# Altium project Buck_converter.PrjPcb
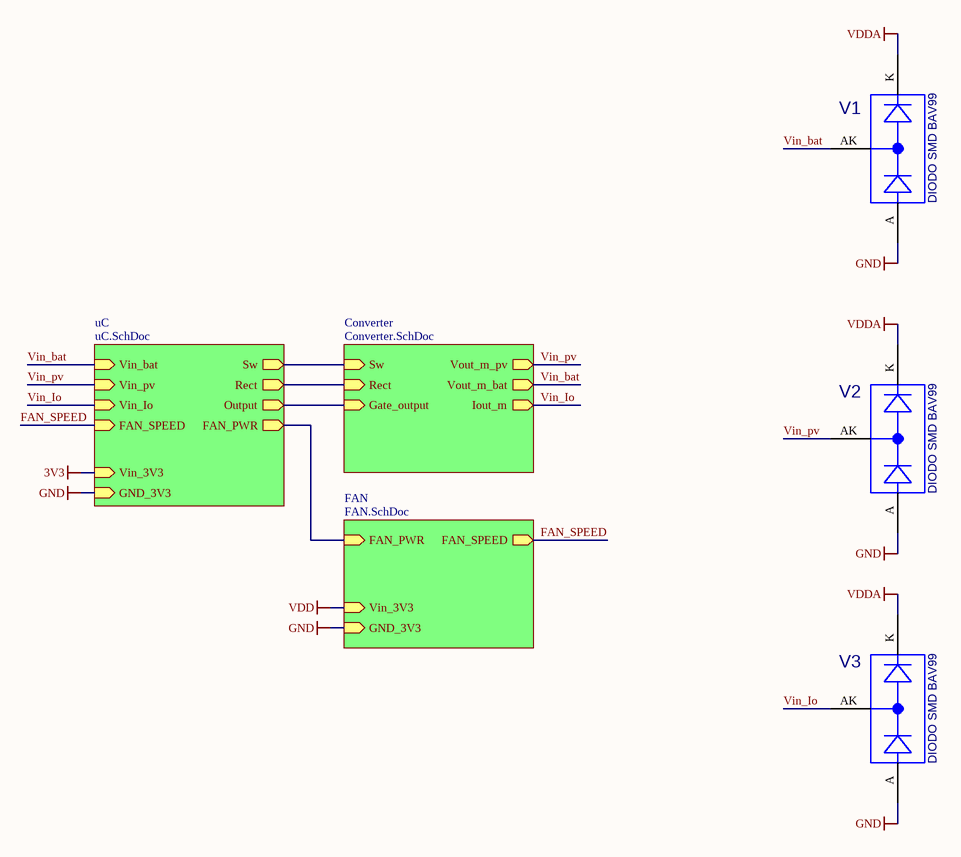
[diagram p0: Buck_converter.SchDoc]
Address1: Fábio Cadore Posser; Address2: Naelton Oliveira de Souza; organization: UDESC; SheetNumber: $SheetNumber; SheetTotal: $SheetTotal; Title: Buck Sinc Converter
10 sheets, 147 parts. Net scope: hierarchical (ports join the sheet entries above them; power ports are global).
Board file: Conv_buck_R1.PcbDoc
Sheets:
  Buck_converter.SchDoc
    uC = uC.SchDoc
    Converter = Converter.SchDoc
      Voltage_measure_pv = Voltage_measure.SchDoc
      Voltage_measure_bat = Voltage_measure.SchDoc
      Driver_rect = Driver_rect.SchDoc
      Current_measure_bat = Current_measure.SchDoc
      SMPS = SMPS.SchDoc
      Driver_SW = Driver_SW.SchDoc
      Output = Output.SchDoc
    FAN = FAN.SchDoc

## Sheet Buck_converter.SchDoc: Buck Sinc Converter
size A4; Organization: UDESC; Revision: R0; SheetNumber: 1; SheetTotal: 10

### Parts
V1  value DIODO SMD BAV99  [SOT23-BAV99A]  (hidden comment: 10574587)
V2  value DIODO SMD BAV99  [SOT23-BAV99A]  (hidden comment: 10574587)
V3  value DIODO SMD BAV99  [SOT23-BAV99A]  (hidden comment: 10574587)

### Sub-sheets
Converter = Converter.SchDoc: Sw (in), Rect (in), Vout_m_pv (out), Vout_m_bat (out), Iout_m (out), Gate_output (in)
FAN = FAN.SchDoc: FAN_PWR (in), GND_3V3 (in), FAN_SPEED (out), Vin_3V3 (in)
uC = uC.SchDoc: Vin_3V3 (in), GND_3V3 (in), Sw (out), Rect (out), Vin_bat (in), Vin_pv (in), Vin_Io (in), Output (out), FAN_SPEED (in), FAN_PWR (out)

### Nets
GND: V1.A V2.A V3.A ; sheet uC/GND_3V3, sheet FAN/GND_3V3
VDDA: V1.K V2.K V3.K
FAN_SPEED: sheet uC/FAN_SPEED, sheet FAN/FAN_SPEED
PWM1A: sheet uC/FAN_PWR, sheet FAN/FAN_PWR
PWM1B: sheet uC/Output, sheet Converter/Gate_output
PWM2B: sheet uC/Sw, sheet Converter/Sw
PWM3A: sheet uC/Rect, sheet Converter/Rect
Vin_bat: V1.AK ; sheet uC/Vin_bat, sheet Converter/Vout_m_bat  [project net Vbat]
Vin_Io: V3.AK ; sheet uC/Vin_Io, sheet Converter/Iout_m  [project net Io]
Vin_pv: V2.AK ; sheet uC/Vin_pv, sheet Converter/Vout_m_pv

### Notes on the sheet
- Title
- Size:
- Date:
- A4
- Number:
- Time:
- Revision:
- Sheet
- of
- File:

### Library data of the parts
V1-V3 = DIODO BAS40: DIODO SMD BAV99; HISitem: Criado em 06/04/15 (p/ Ricardo); PN: 10574587; PMT: SMD; ComponentLink1URL: http://www.onsemi.com/pub_link/Collateral/BAS40-04LT1-D.PDF

## Sheet uC.SchDoc: Buck Sinc Converter
size A4; Organization: UDESC; Revision: R0; SheetNumber: 8; SheetTotal: 10
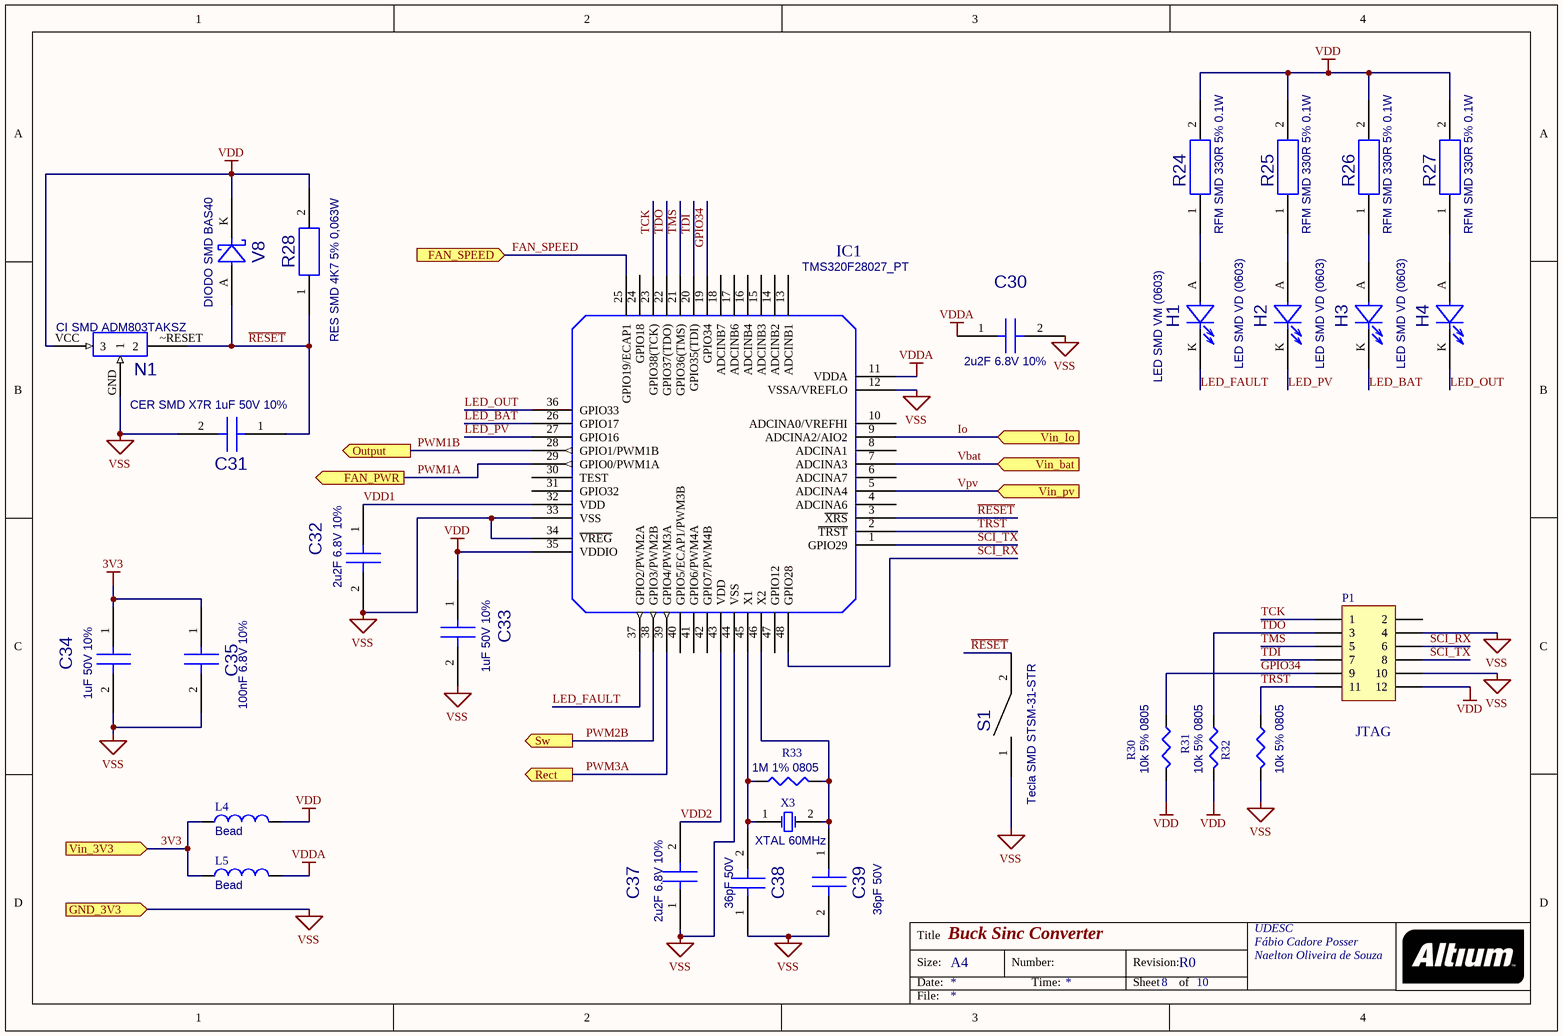
[diagram p1: uC.SchDoc]

### Parts
C30  2u2F 6.8V 10%  [C0805_R_V0]
C31  value CER SMD X7R 1uF 50V 10%  [C0805_R_V0]  (hidden comment: 11736520)
C32  2u2F 6.8V 10%  [C0805_R_V0]
C33  1uF 50V 10%  [C0805_R_V0]
C34  1uF 50V 10%  [C0805_R_V0]
C35  100nF 6.8V 10%  [C0805_R_V0]
C37  2u2F 6.8V 10%  [C0805_R_V0]
C38  36pF 50V  [C0805_R_V0]
C39  36pF 50V  [C0805_R_V0]
H1  value LED SMD VM (0603)  [LED 0603_12133537(Primary)]  (hidden comment: 12133537)
H2  value LED SMD VD (0603)  [LED 0603_12133535(Primary)]  (hidden comment: 12133535)
H3  value LED SMD VD (0603)  [LED 0603_12133535(Primary)]  (hidden comment: 12133535)
H4  value LED SMD VD (0603)  [LED 0603_12133535(Primary)]  (hidden comment: 12133535)
IC1  TMS320F28027_PT  [LQFP48]
L4  value Bead  [R0805_R_V0]  (hidden comment: Inductor)
L5  value Bead  [R0805_R_V0]  (hidden comment: Inductor)
N1  value CI SMD ADM803TAKSZ  [SC70A]  (hidden comment: 10050567)
P1  Header 6X2  [HDR2X6]  (value not drawn)
R24  value RFM SMD 330R 5% 0.1W  [R0805_R_V0]  (hidden comment: 10191962)
R25  value RFM SMD 330R 5% 0.1W  [R0805_R_V0]  (hidden comment: 10191962)
R26  value RFM SMD 330R 5% 0.1W  [R0805_R_V0]  (hidden comment: 10191962)
R27  value RFM SMD 330R 5% 0.1W  [R0805_R_V0]  (hidden comment: 10191962)
R28  value RES SMD 4K7 5% 0,063W  [R0805_R_V0]  (hidden comment: 11417855)
R30  value 10k 5% 0805  [R0805_R_V0]  (hidden comment: 1k 5% 0805)
R31  value 10k 5% 0805  [R0805_R_V0]  (hidden comment: 1k 5% 0805)
R32  value 10k 5% 0805  [R0805_R_V0]  (hidden comment: 1k 5% 0805)
R33  1M 1% 0805  [R0805_R_V0]
S1  value Tecla SMD STSM-31-STR  [TECLA STSM BOURNS]  (hidden comment: 10050610)
V8  value DIODO SMD BAS40  [SOT23A]  (hidden comment: 10192124)
X3  XTAL 60MHz  [XTAL  CSTCE_G_A]

### Ports
FAN_PWR (out), FAN_SPEED (in), GND_3V3 (in), Output (out), Rect (out), Sw (out), Vin_3V3 (in), Vin_bat (in), Vin_Io (in), Vin_pv (in)

### Nets
3V3: C34.1 C35.1 L4.1 L5.2 ; port Vin_3V3
VDD: C33.1 IC1.35(VDDIO) L4.2 N1.VCC(3) P1.12 R24.2 R25.2 R26.2 R27.2 R28.2 R30.2 R31.2 V8.K
VDDA: C30.1 IC1.11(VDDA) L5.1
VSS: C30.2 C31.2 C32.2 C33.2 C34.2 C35.2 C37.1 C38.1 C39.2 IC1.12(VSSA/VREFLO) IC1.33(VSS) IC1.34(~{VREG}) IC1.44(VSS) N1.GND(1) P1.4 P1.10 R32.2 S1.1 ; port GND_3V3  [project net GND]
~{RESET}: C31.1 IC1.3(~{XRS}) N1.~RESET(2) R28.1 S1.2 V8.A
FAN_SPEED: IC1.25(GPIO19/ECAP1) ; port FAN_SPEED
GPIO34: IC1.19(GPIO34) P1.9 R30.1
Io: IC1.9(ADCINA2/AIO2) ; port Vin_Io
LED_BAT: H3.K IC1.26(GPIO17)
LED_FAULT: H1.K IC1.37(GPIO2/PWM2A)
LED_OUT: H4.K IC1.36(GPIO33)
LED_PV: H2.K IC1.27(GPIO16)
PWM1A: IC1.29(GPIO0/PWM1A) ; port FAN_PWR
PWM1B: IC1.28(GPIO1/PWM1B) ; port Output
PWM2B: IC1.38(GPIO3/PWM2B) ; port Sw
PWM3A: IC1.39(GPIO4/PWM3A) ; port Rect
SCI_RX: IC1.48(GPIO28) P1.6
SCI_TX: IC1.1(GPIO29) P1.8
TCK: IC1.23(GPIO38(TCK)) P1.1
TDI: IC1.20(GPIO35(TDI)) P1.7
TDO: IC1.22(GPIO37(TDO)) P1.3 R31.1
TMS: IC1.21(GPIO36(TMS)) P1.5
TRST: IC1.2(~{TRST}) P1.11 R32.1
Vbat: IC1.7(ADCINA3) ; port Vin_bat
VDD1: C32.1 IC1.32(VDD)
VDD2: C37.2 IC1.43(VDD)
Vpv: IC1.5(ADCINA4) ; port Vin_pv  [project net Vin_pv]
NetC38_2: C38.2 IC1.45(X1) R33.1 X3.1(OSC1)
NetC39_1: C39.1 IC1.46(X2) R33.2 X3.2(OSC2)
NetH1_A: H1.A R24.1
NetH2_A: H2.A R25.1
NetH3_A: H3.A R26.1
NetH4_A: H4.A R27.1

Not connected (* = marked no-connect by the designer): IC1 4(ADCINA6) 6(ADCINA7) 8(ADCINA1) 10(ADCINA0/VREFHI) 13(ADCINB1) 14(ADCINB2) 15(ADCINB3) 16(ADCINB4) 17(ADCINB6) 18(ADCINB7) 24(GPIO18) 30(TEST) 31(GPIO32) 40(GPIO5/ECAP1/PWM3B) 41(GPIO6/PWM4A) 42(GPIO7/PWM4B) 47(GPIO12); P1 2; V8 NC

### Notes on the sheet
- (near P1) JTAG
- Title
- Size:
- Date:
- A4
- Number:
- Time:
- Revision:
- Sheet
- of
- File:

### Library data of the parts
C30 C32 C37 = 11736520: CER SMD X7R 1uF 50V 10%; HISsym: Atualizado em 12/07/05; PN: 10192095; HISitem: Criado em 15/04/11 (p/ Sandro W.); PMT: SMD; Value: 2u2F 6.8V 10%
C31 C33 C34 = 11736520: CER SMD X7R 1uF 50V 10%; HISsym: Atualizado em 12/07/05; HISitem: Criado em 15/04/11 (p/ Sandro W.); PN: 11736520; PMT: SMD
  C33 C34: Value: 1uF 50V 10%
C35 = 11736520: CER SMD X7R 1uF 50V 10%; HISsym: Atualizado em 12/07/05; PN: 10192075; HISitem: Criado em 15/04/11 (p/ Sandro W.); PMT: SMD; Value: 100nF 6.8V 10%
C38 C39 = 11736520: CER SMD C0G 36pF 50V; HISsym: Atualizado em 12/07/05; HISitem: Criado em 15/04/11 (p/ Sandro W.); PN: 11736520; PMT: SMD; Value: 36pF 50V
H1 = 12133537: LED SMD VM (0603); HISitem: Criado em 31/08/11 (p/ Ricardo); PN: 12133537; PMT: SMD
H2-H4 = 12133535: LED SMD VD (0603); HISitem: Criado em 31/08/11 (p/ Ricardo); PN: 12133535; PMT: SMD
IC1 = TMS320F28027_PT: LQFP48; EECON Code: XXX; Text Field 1: TEXAS; Componente: DSX LQFP48; Text Field: TMS320F28027_PT; DES: XXX; Value: TMS320F28027_PT
L4 L5 = Inductor: Code_IEC: 1005; PN: 12436892; Published: 8-Jun-2000; LatestRevisionDate: 29-May-2009; LatestRevisionNote: IPC-7351 Footprint Added.; PackageReference: 0402-A; Publisher: Altium Limited; PackageDescription: Chip Inductor; Code_JEITA: 0402
N1 = 10050567: CI SMD ADM803TAKSZ; HISsym: Atualizado em 16/08/05; HISitem: Alterado encaps. para SC70 em 16/08/05; PN: 10050567; PMT: SMD
P1 = Header 6X2: Header, 6-Pin, Dual row; LatestRevisionDate: 17-Jul-2002; LatestRevisionNote: Re-released for DXP Platform.; Publisher: Altium Limited
R24-R27 = 10191962: RFM SMD 330R 5% 0.1W; HISsym: Atualizado em 20/07/05; PN: 10191962; PMT: SMD
R28 = 11417855: RES SMD 4K7 5% 0,063W; HISsym: Atualizado em 20/07/05; HISitem: Criado em 23/04/10 (p/ Ricardo); PN: 11417855; PMT: SMD
R30-R32 = Res3_2: Resistor; PN: 10192008; PMT: SMD; Published: 8-Jun-2000; LatestRevisionDate: 29-May-2009; LatestRevisionNote: IPC-7351 Footprint Added.; PackageReference: J1-0603; Publisher: Altium Limited; PackageDescription: Chip Resistor
R33 = Res3_2: Resistor; PN: 10118079; PMT: SMD; Published: 8-Jun-2000; LatestRevisionDate: 29-May-2009; LatestRevisionNote: IPC-7351 Footprint Added.; PackageReference: J1-0603; Publisher: Altium Limited; PackageDescription: Chip Resistor; Value: 1M 1% 0805
S1 = 10050610: Tecla SMD STSM-31-STR; NUMBER PIN: 02; PN: 10050610; PMT: SMD
V8 = 10192124: DIODO SMD BAS40; HISsym: Atualizado em 10/07/06; NUMBER PIN: 02; PN: 10192124; PMT: SMD
X3 = XTAL: Crystal Oscillator; PMT: SMD; Published: 8-Jun-2000; LatestRevisionDate: 17-Jul-2002; LatestRevisionNote: Re-released for DXP Platform.; PackageReference: R38; Publisher: Altium Limited; Value: XTAL 60MHz

## Sheet Converter.SchDoc: Buck Sinc Converter
size A4; Organization: UDESC; Revision: R0; SheetNumber: 2; SheetTotal: 10
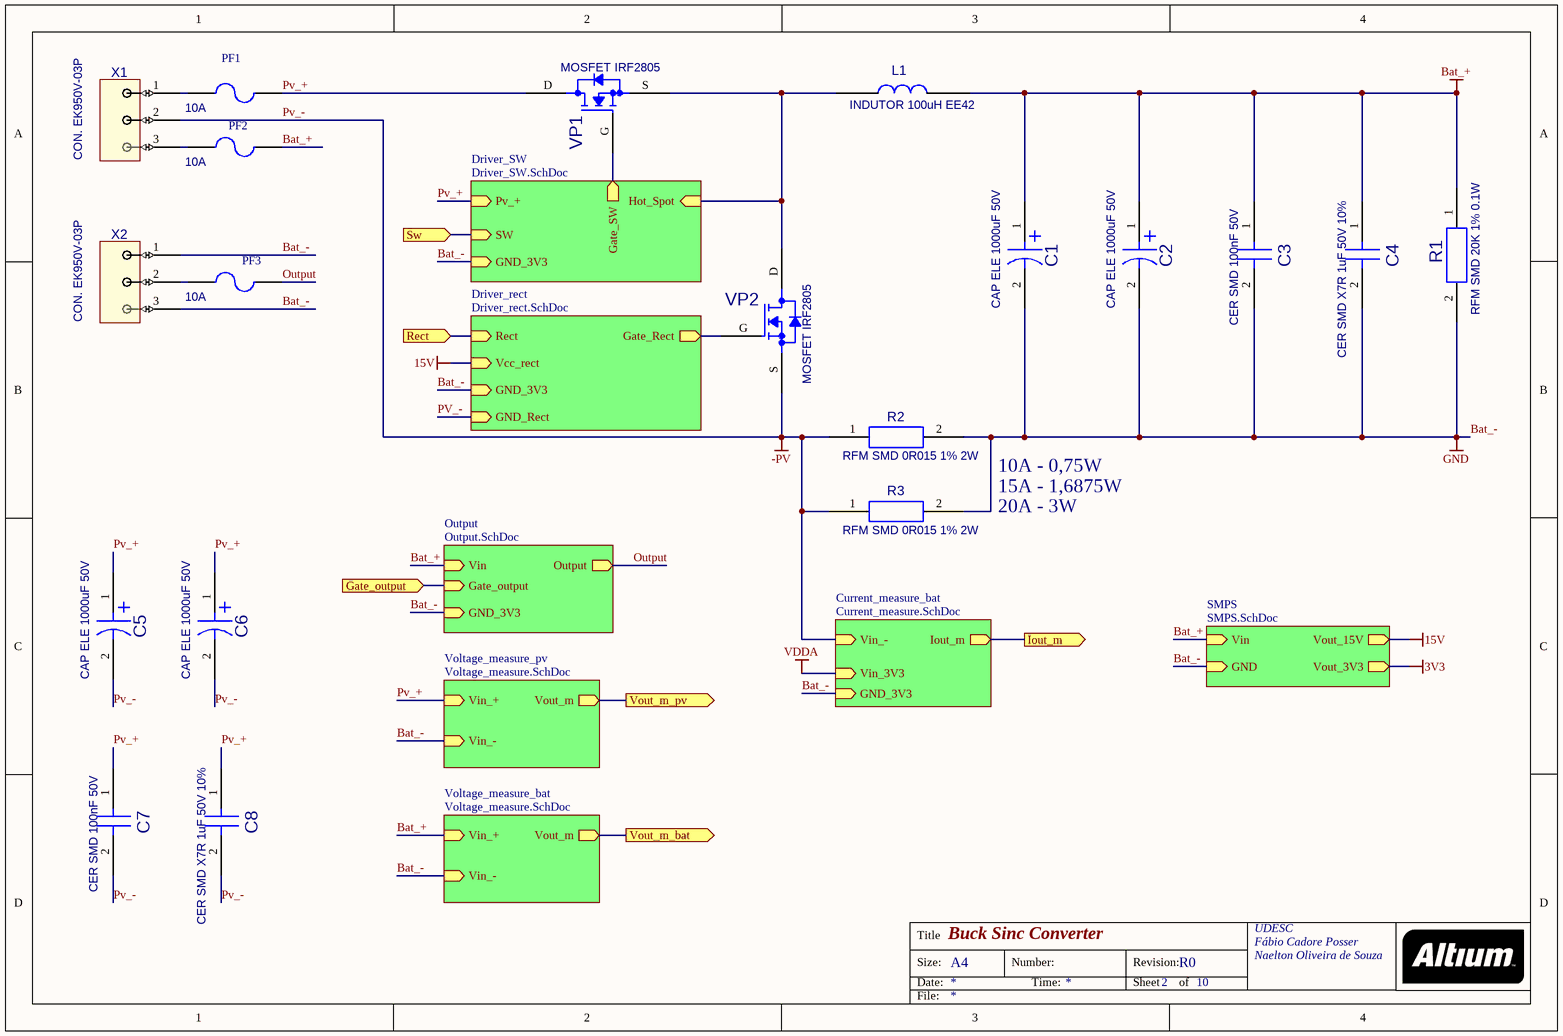
[diagram p2: Converter.SchDoc]

### Parts
C1  value CAP ELE 1000uF 50V  [CR 1.1 7.62 16.5]  (hidden comment: 10190340)
C2  value CAP ELE 1000uF 50V  [CR 1.1 7.62 16.5]  (hidden comment: 10190340)
C3  value CER SMD 100nF 50V  [C0805_R_V0]  (hidden comment: 10192075)
C4  value CER SMD X7R 1uF 50V 10%  [C0805_R_V0]  (hidden comment: 11736520)
C5  value CAP ELE 1000uF 50V  [CR 1.1 7.62 16.5]  (hidden comment: 10190340)
C6  value CAP ELE 1000uF 50V  [CR 1.1 7.62 16.5]  (hidden comment: 10190340)
C7  value CER SMD 100nF 50V  [C0805_R_V0]  (hidden comment: 10192075)
C8  value CER SMD X7R 1uF 50V 10%  [C0805_R_V0]  (hidden comment: 11736520)
L1  INDUTOR 100uH EE42  [INDUTOR EE42_V1]
PF1  10A  [Fuse_holder]
PF2  10A  [Fuse_holder]
PF3  10A  [Fuse_holder]
R1  value RFM SMD 20K 1% 0.1W  [R0805A]  (hidden comment: 10191996)
R2  value RFM SMD 0R015 1% 2W  [WSL2816A]  (hidden comment: 11372881)
R3  value RFM SMD 0R015 1% 2W  [WSL2816A]  (hidden comment: 11372881)
VP1  value MOSFET IRF2805  [TO-220AB_V1]  (hidden comment: 10190449)
VP2  value MOSFET IRF2805  [TO-220AB_V1]  (hidden comment: 10190449)
X1  value CON. EK950V-03P  [662-A-111/03-SM]  (hidden comment: 10233722)
X2  value CON. EK950V-03P  [662-A-111/03-SM]  (hidden comment: 10233722)

### Sub-sheets
Current_measure_bat = Current_measure.SchDoc: Vin_- (in), Iout_m (out), Vin_3V3 (in), GND_3V3 (in)
Driver_rect = Driver_rect.SchDoc: Rect (in), Gate_Rect (out), GND_3V3 (in), Vcc_rect (in), GND_Rect (in)
Driver_SW = Driver_SW.SchDoc: Pv_+ (in), Gate_SW (out), GND_3V3 (in), SW (in), Hot_Spot (in)
Output = Output.SchDoc: Gate_output (in), GND_3V3 (in), Output (out), Vin (in)
SMPS = SMPS.SchDoc: Vin (in), GND (in), Vout_3V3 (out), Vout_15V (out)
Voltage_measure_bat = Voltage_measure.SchDoc: Vin_+ (in), Vin_- (in), Vout_m (out)
Voltage_measure_pv = Voltage_measure.SchDoc: Vin_+ (in), Vin_- (in), Vout_m (out)

### Ports
Gate_output (in), Iout_m (out), Rect (in), Sw (in), Vout_m_bat (out), Vout_m_pv (out)

### Nets
15V: sheet Driver_rect/Vcc_rect, sheet SMPS/Vout_15V
-PV: C5.2 C6.2 C7.2 C8.2 R2.1 R3.1 VP2.S X1.2 ; sheet Driver_rect/GND_Rect, sheet Current_measure_bat/Vin_-  [also labelled Pv_-]
Bat_+: C1.1 C2.1 C3.1 C4.1 L1.2 PF2.2 R1.1 ; sheet Voltage_measure_bat/Vin_+, sheet SMPS/Vin, sheet Output/Vin
GND: C1.2 C2.2 C3.2 C4.2 R1.2 R2.2 R3.2 X2.1 X2.3 ; sheet Voltage_measure_pv/Vin_-, sheet Voltage_measure_bat/Vin_-, sheet Driver_rect/GND_3V3, sheet Current_measure_bat/GND_3V3, sheet SMPS/GND, sheet Driver_SW/GND_3V3, sheet Output/GND_3V3  [also labelled Bat_-]
Gate_Rect: VP2.G ; sheet Driver_rect/Gate_Rect
Gate_SW: VP1.G ; sheet Driver_SW/Gate_SW
Hot_Spot: L1.1 VP1.S VP2.D ; sheet Driver_SW/Hot_Spot
Io: port Iout_m, sheet Current_measure_bat/Iout_m
Output: PF3.2 ; sheet Output/Output
Pv_+: C5.1 C6.1 C7.1 C8.1 PF1.2 VP1.D ; sheet Voltage_measure_pv/Vin_+, sheet Driver_SW/Pv_+
PWM1B: port Gate_output, sheet Output/Gate_output
PWM2B: port Sw, sheet Driver_SW/SW
PWM3A: port Rect, sheet Driver_rect/Rect
Vbat: port Vout_m_bat, sheet Voltage_measure_bat/Vout_m
Vin_pv: port Vout_m_pv, sheet Voltage_measure_pv/Vout_m
NetPF1_1: PF1.1 X1.1
NetPF2_1: PF2.1 X1.3
NetPF3_1: PF3.1 X2.2

### Notes on the sheet
- 10A - 0,75W
- 15A - 1,6875W
- 20A - 3W
- Title
- Size:
- Date:
- A4
- Number:
- Time:
- Revision:
- Sheet
- of
- File:

### Library data of the parts
C1 C2 C5 C6 = 10190340: CAP ELE 1000uF 50V; HISsym: Atualizado em 19/10/05; TOL: 20%; PMT: THT; PN: 10190340
C3 C7 = 10192075: CER SMD 100nF 50V; HISsym: Atualizado em 12/07/05; TOL: 10%; ITEM BAAN: 0333.0044; PN: 10192075; PMT: SMD
C4 C8 = 11736520: as C31 on sheet uC; PN: 11736520; PMT: SMD
L1 = 12578205: INDUTOR 560uH 4A PCV-2; HISitem: Criado em 18/04/13 (p/ Adriano); Altura: 28mm; PMT: THT; PN: 12578205; ComponenteLink1URL: http://www.coilcraft.com/pdfs/pcv.pdf; Value: INDUTOR 100uH EE42
PF1 = Fuse 2: PN: FUSE; PMT: THT; Published: 8-Jun-2000; LatestRevisionDate: 17-Jul-2002; LatestRevisionNote: Re-released for DXP Platform.; PackageReference: PIN-W2/E2.8; Publisher: Altium Limited; Value: 10A
PF2 PF3 = Fuse 2: Fuse; PMT: THT; Published: 8-Jun-2000; LatestRevisionDate: 17-Jul-2002; LatestRevisionNote: Re-released for DXP Platform.; PackageReference: PIN-W2/E2.8; Publisher: Altium Limited; PN: 10A; Value: 10A
R1 = 10191996: RFM SMD 20K 1% 0.1W; HISsym: Atualizado em 20/07/05; PN: 10191996; PMT: SMD
R2 R3 = 11372881: RFM SMD 0R015 1% 2W; HISsym: Atualizado em 20/07/05; HISitem: Criado em 19/01/10 (p/ Emilio); PN: 11372881; PMT: SMD; ComponentLink1URL: *
VP1 VP2 = 10190449: MOSFET IRFB31N20D; HISsym: Atualizado em 20/04/06; HISitem: Criado em 20/04/06; PMT: THT; PN: 10190449
X1 X2 = 10233722: CON. EK950V-03P; HISitem: Atualizado Pattern em 01/09/06; Altura: 21,6mm; PMT: THT; PN: 10233722; ComponentLink1URL: *

## Sheet Voltage_measure.SchDoc: Buck Sinc Converter
size A4; Organization: UDESC; Revision: R0; SheetNumber: 6; SheetTotal: 10
Used 2 times, as channels Converter/Voltage_measure_pv, Converter/Voltage_measure_bat. Parts and nets are listed once, with the designators drawn on the sheet.
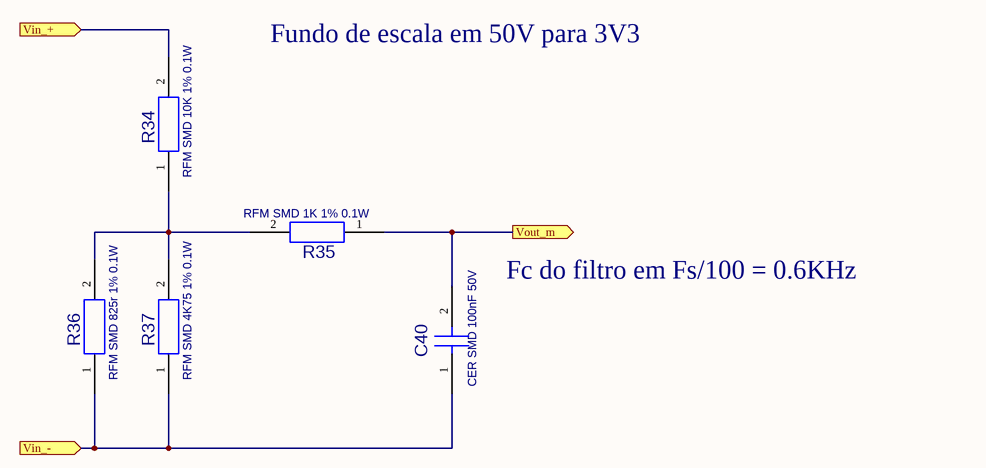
[diagram p3: Voltage_measure.SchDoc]

### Parts
C40  value CER SMD 100nF 50V  [C0805_R_V0]  (hidden comment: 10192075)
R34  value RFM SMD 10K 1% 0.1W  [R0805_R_V0]  (hidden comment: 10118076)
R35  value RFM SMD 1K 1% 0.1W  [R0805_R_V0]  (hidden comment: 10118077)
R36  value RFM SMD 825r 1% 0.1W  [R0805_R_V0]  (hidden comment: 10191983)
R37  value RFM SMD 4K75 1% 0.1W  [R0805_R_V0]  (hidden comment: 10191972)

### Ports
Vin_+ (in), Vin_- (in), Vout_m (out)

### Nets
Vin_+: R34.2 ; port Vin_+
Vin_-: C40.1 R36.1 R37.1 ; port Vin_-
Vout_m: C40.2 R35.1 ; port Vout_m
NetR34_1: R34.1 R35.2 R36.2 R37.2

### Channels
Converter/Voltage_measure_pv: designators C40=C47 R34=R54 R35=R55 R36=R56 R37=R57; ports Vin_+=Pv_+ Vin_-=GND Vout_m=Vin_pv
Converter/Voltage_measure_bat: designators C40=C46#1 R34=R50#1 R35=R51#1 R36=R52#1 R37=R53#1; ports Vin_+=Bat_+ Vin_-=GND Vout_m=Vbat

### Notes on the sheet
- Fundo de escala em 50V para 3V3
- Fc do filtro em Fs/100 = 0.6KHz
- Title
- Size:
- Date:
- A4
- Number:
- Time:
- Revision:
- Sheet
- of
- File:

### Library data of the parts
C40 = 10192075: as C3 on sheet Converter; PN: 10192075; PMT: SMD
R34 = 10118077: RFM SMD 10K 1% 0.1W; HISsym: Atualizado em 20/07/05; PN: 10118076; PMT: SMD
R35 = 10118077: RFM SMD 1K 1% 0.1W; HISsym: Atualizado em 20/07/05; PN: 10118077; PMT: SMD
R36 = 10118077: RFM SMD 825r 1% 0.1W; HISsym: Atualizado em 20/07/05; PN: 10191983; PMT: SMD
R37 = 10118077: RFM SMD 4K75 1% 0.1W; HISsym: Atualizado em 20/07/05; PN: 10191972; PMT: SMD

## Sheet Driver_rect.SchDoc: Buck Sinc Converter
size A4; Organization: UDESC; Revision: R0; SheetNumber: 4; SheetTotal: 10; DocumentFullPathAndName: PROJETO PSE
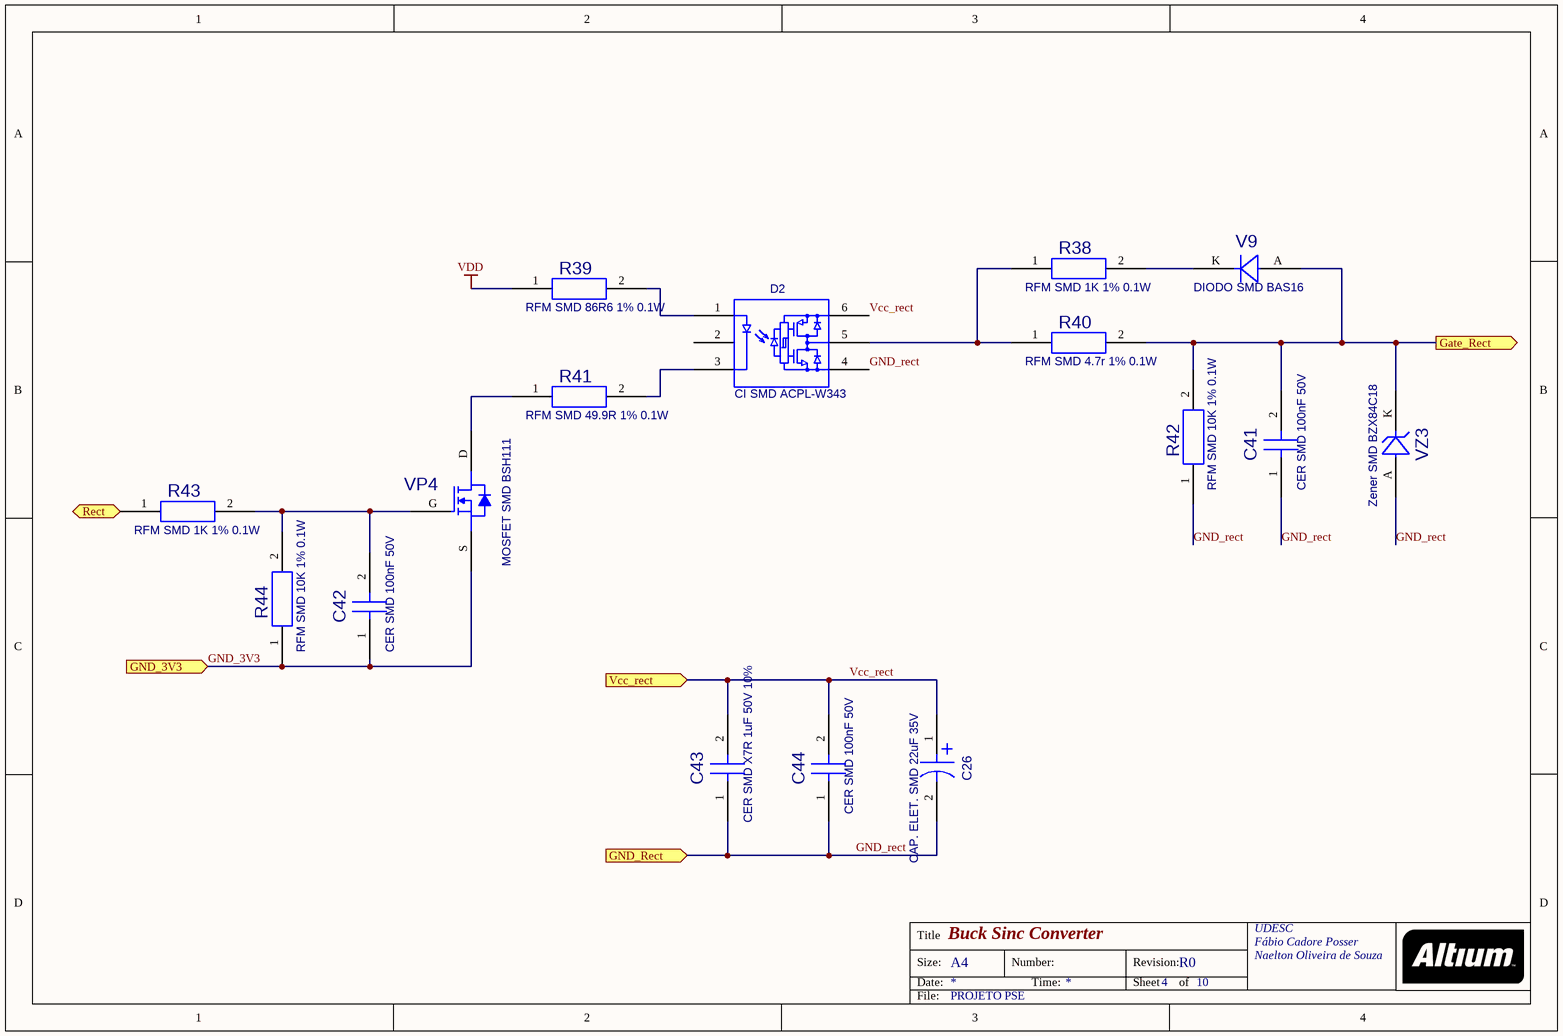
[diagram p4: Driver_rect.SchDoc]

### Parts
C26  value CAP. ELET. SMD 22uF 35V  [CAP UUD CR 5X5.8]  (hidden comment: 11690909)
C41  value CER SMD 100nF 50V  [C0805_R_V0]  (hidden comment: 10192075)
C42  value CER SMD 100nF 50V  [C0805_R_V0]  (hidden comment: 10192075)
C43  value CER SMD X7R 1uF 50V 10%  [C0805_R_V0]  (hidden comment: 11736520)
C44  value CER SMD 100nF 50V  [C0805_R_V0]  (hidden comment: 10192075)
D2  value CI SMD ACPL-W343  [SO-6 (11.5 MM)]  (hidden comment: 12544475)
R38  value RFM SMD 1K 1% 0.1W  [R0805_R_V0]  (hidden comment: 10118077)
R39  value RFM SMD 86R6 1% 0.1W  [R0805_R_V0]  (hidden comment: 10192050)
R40  value RFM SMD 4.7r 1% 0.1W  [R0805_R_V0]  (hidden comment: 10192015)
R41  value RFM SMD 49.9R 1% 0.1W  [R0805_R_V0]  (hidden comment: 10192035)
R42  value RFM SMD 10K 1% 0.1W  [R0805_R_V0]  (hidden comment: 10118076)
R43  value RFM SMD 1K 1% 0.1W  [R0805_R_V0]  (hidden comment: 10118077)
R44  value RFM SMD 10K 1% 0.1W  [R0805_R_V0]  (hidden comment: 10118076)
V9  value DIODO SMD BAS16  [SOT23A]  (hidden comment: 10261302)
VP4  value MOSFET SMD BSH111  [MOS_SOT23A]  (hidden comment: 11110327)
VZ3  value Zener SMD BZX84C18  [ZEN_SOT23A]  (hidden comment: 10050447)

### Ports
Gate_Rect (out), GND_3V3 (in), GND_Rect (in), Rect (in), Vcc_rect (in)

### Nets
GND_3V3: C42.1 R44.1 VP4.S ; port GND_3V3  [project net GND]
GND_rect: C26.2 C41.1 C43.1 C44.1 D2.4(VEE) R42.1 VZ3.A ; port GND_Rect  [project net -PV]
Vcc_rect: C26.1 C43.2 C44.2 D2.6(VCC) ; port Vcc_rect  [project net 15V]
VDD: R39.1
Gate_Rect: C41.2 R40.2 R42.2 V9.A VZ3.K ; port Gate_Rect
PWM3A: R43.1 ; port Rect
NetC42_2: C42.2 R43.2 R44.2 VP4.G
NetD2_1: D2.1(A) R39.2
NetD2_3: D2.3(K) R41.2
NetD2_5: D2.5(VOUT) R38.1 R40.1
NetR38_2: R38.2 V9.K
NetR41_1: R41.1 VP4.D

Not connected (* = marked no-connect by the designer): D2 2; V9 NC; VZ3 NC

### Notes on the sheet
- Title
- Size:
- Date:
- A4
- Number:
- Time:
- Revision:
- Sheet
- of
- File:

### Library data of the parts
C26 = 11690909: CAP. ELET. SMD 22uF 35V; HISsym: Atualizado em 20/12/05; TOL: 20%; HISitem: Criado em 02/03/11 (p/ Osnir); Altura: 5,8mm; PN: 11690909; PMT: SMD; ComponenteLink1URL: *
C41 C42 C44 = 10192075: as C3 on sheet Converter; PN: 10192075; PMT: SMD
C43 = 11736520: as C31 on sheet uC; PN: 11736520; PMT: SMD
D2 = 12544475: CI SMD ACPL-W343; HISitem: Criado em 04/04/13 (p/ Geovani); PN: 12544475; PMT: SMD; ComponentLink1URL: http://www.avagotech.com/docs/AV02-2928EN
R38 R43 = 10118077: as R35 on sheet Voltage_measure; PN: 10118077; PMT: SMD
R39 = 10118077: RFM SMD 86R6 1% 0.1W; HISsym: Atualizado em 20/07/05; PN: 10192050; PMT: SMD
R40 = 10118077: RFM SMD 4.7r 1% 0.1W; HISsym: Atualizado em 20/07/05; PN: 10192015; PMT: SMD
R41 = 10118077: RFM SMD 49.9R 1% 0.1W; HISsym: Atualizado em 20/07/05; PN: 10192035; PMT: SMD
R42 R44 = 10118077: as R34 on sheet Voltage_measure; PN: 10118076; PMT: SMD
V9 = 10261302: DIODO SMD BAS16; HISsym: Atualizado em 17/04/06; VAL: 200mA; PN: 10261302; PMT: SMD
VP4 = 11110327: MOSFET SMD BSH111; HISsym: Atualizado em 12/09/05; HISitem: Criado em 20/12/07 (p/ Ricardo); PN: 11110327; PMT: SMD
VZ3 = 10050447: Zener  SMD BZX84C18; HISsym: Atualizado em 11/07/06; NUMBER PIN: 03; PN: 10050447; PMT: SMD

## Sheet Current_measure.SchDoc: Buck Sinc Converter
size A4; Organization: UDESC; Revision: R0; SheetNumber: 5; SheetTotal: 10
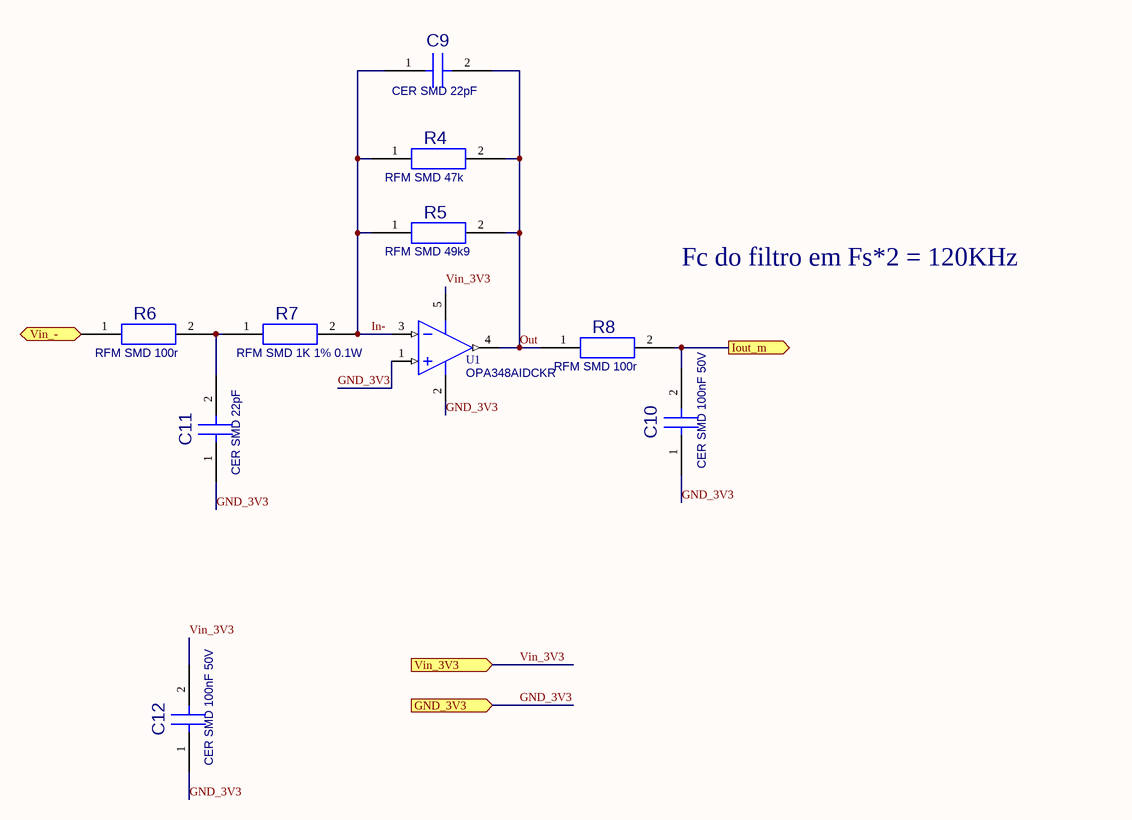
[diagram p5: Current_measure.SchDoc]

### Parts
C9  value CER SMD 22pF  [C0805_R_V0]  (hidden comment: 10192073)
C10  value CER SMD 100nF 50V  [C0805_R_V0]  (hidden comment: 10192075)
C11  value CER SMD 22pF  [C0805_R_V0]  (hidden comment: 10192073)
C12  value CER SMD 100nF 50V  [C0805_R_V0]  (hidden comment: 10192075)
R4  value RFM SMD 47k  [R0805_R_V0]  (hidden comment: 12314309)
R5  value RFM SMD 49k9  [R0805_R_V0]  (hidden comment: 10192018)
R6  value RFM SMD 100r  [R0805_R_V0]  (hidden comment: 10118083)
R7  value RFM SMD 1K 1% 0.1W  [R0805_R_V0]  (hidden comment: 10118077)
R8  value RFM SMD 100r  [R0805_R_V0]  (hidden comment: 10118083)
U1  OPA348AIDCKR  [DCK R-PDSO-G5]

### Ports
GND_3V3 (in), Iout_m (out), Vin_3V3 (in), Vin_- (in)

### Nets
-PV: R6.1 ; port Vin_-
GND_3V3: C10.1 C11.1 C12.1 U1.1(IN+) U1.2(V-) ; port GND_3V3  [project net GND]
Vin_3V3: C12.2 U1.5(V+) ; port Vin_3V3  [project net VDDA]
In-: C9.1 R4.1 R5.1 R7.2 U1.3(IN-)
Io: C10.2 R8.2 ; port Iout_m
Out: C9.2 R4.2 R5.2 R8.1 U1.4(OUT)
NetC11_2: C11.2 R6.2 R7.1

### Notes on the sheet
- Fc do filtro em Fs*2 = 120KHz
- Title
- Size:
- Date:
- A4
- Number:
- Time:
- Revision:
- Sheet
- of
- File:

### Library data of the parts
C9 C11 = 10192075: CER SMD 22pF; HISsym: Atualizado em 12/07/05; TOL: 10%; ITEM BAAN: 0333.0044; PN: 10192073; PMT: SMD
C10 C12 = 10192075: as C3 on sheet Converter; PN: 10192075; PMT: SMD
R4 = 10118077: RFM SMD 47k; HISsym: Atualizado em 20/07/05; PN: 12314309; PMT: SMD
R5 = 10118077: RFM SMD 49k9; HISsym: Atualizado em 20/07/05; PN: 10192018; PMT: SMD
R6 R8 = 10118077: RFM SMD 100r; HISsym: Atualizado em 20/07/05; PN: 10118083; PMT: SMD
R7 = 10118077: as R35 on sheet Voltage_measure; PN: 10118077; PMT: SMD
U1 = OPA348AIDCKR: 1 MHz, 45 uA, RRIO, Single Operational Amplifier, 2.1 to 5.5 V, -40 to 125 degC, 5-pin SOT23 (DCK5), Green (RoHS & no Sb/Br); Manufacturer: Texas Instruments; CMRR(Min)(dB): 70; GBW(Typ)(MHz): 1; IIB(Max)(pA): 10; Iq per channel(Max)(mA): 0.065; Offset Drift(Typ)(uV/C): 4; Packing: LARGE T&R; Rating: Catalog; Slew Rate(Typ)(V/us): 0.5; Sub Family: Low Input Bias Current Amp (<=10pA), Low Power Amp (<=500uA), Low Supply Voltage Amplifier (<=2.7V), Precision Amplifier; Total Supply Voltage(Max)(+5V is 5, +/-5V is 10): 5.5; Total Supply Voltage(Min)(+5V is 5, +/-5V is 10): 2.1; Vio (25C)(Max)(mV): 5; PN: 11354940; PMT: SMD; DatasheetVersion: SBOS213G; PackageVersion: 4093553-3/G, 01/2007; PackageReference: DCK5; PackageDescription: 5-Pin Plastic Small Outline, Body 2 x 1.25 mm, Pitch 0.65 mm; Supplier 1: Digi-Key; Supplier Part Number 1: 296-27989-2-ND; Supplier 2: Digi-Key; Supplier Part Number 2: 296-27989-1-ND; Supplier 3: Digi-Key; Supplier Part Number 3: 296-27989-6-ND; Supplier 4: Newark; Supplier Part Number 4: 86W6065; Supplier 5: Newark; Supplier Part Number 5: 75C4889; Supplier 6: Mouser; Supplier Part Number 6: 595-OPA348AIDCKR; Eco-Plan: Green (RoHS & no Sb/Br); Number of Channels: 1; Mounting Technology: Surface Mount; Code_JEDEC: MO-203; ComponentLink1Description: Manufacturer URL; ComponentLink1URL: http://www.ti.com/; ComponentLink2Description: Datasheet; ComponentLink2URL: http://www.ti.com/lit/ds/symlink/opa348.pdf; ComponentLink3Description: Package Specification; ComponentLink3URL: http://www.ti.com/litv/pdf/mpds025f; Value: OPA348AIDCKR

## Sheet SMPS.SchDoc: Buck Sinc Converter
size A4; Organization: UDESC; Revision: R0; SheetNumber: 7; SheetTotal: 10
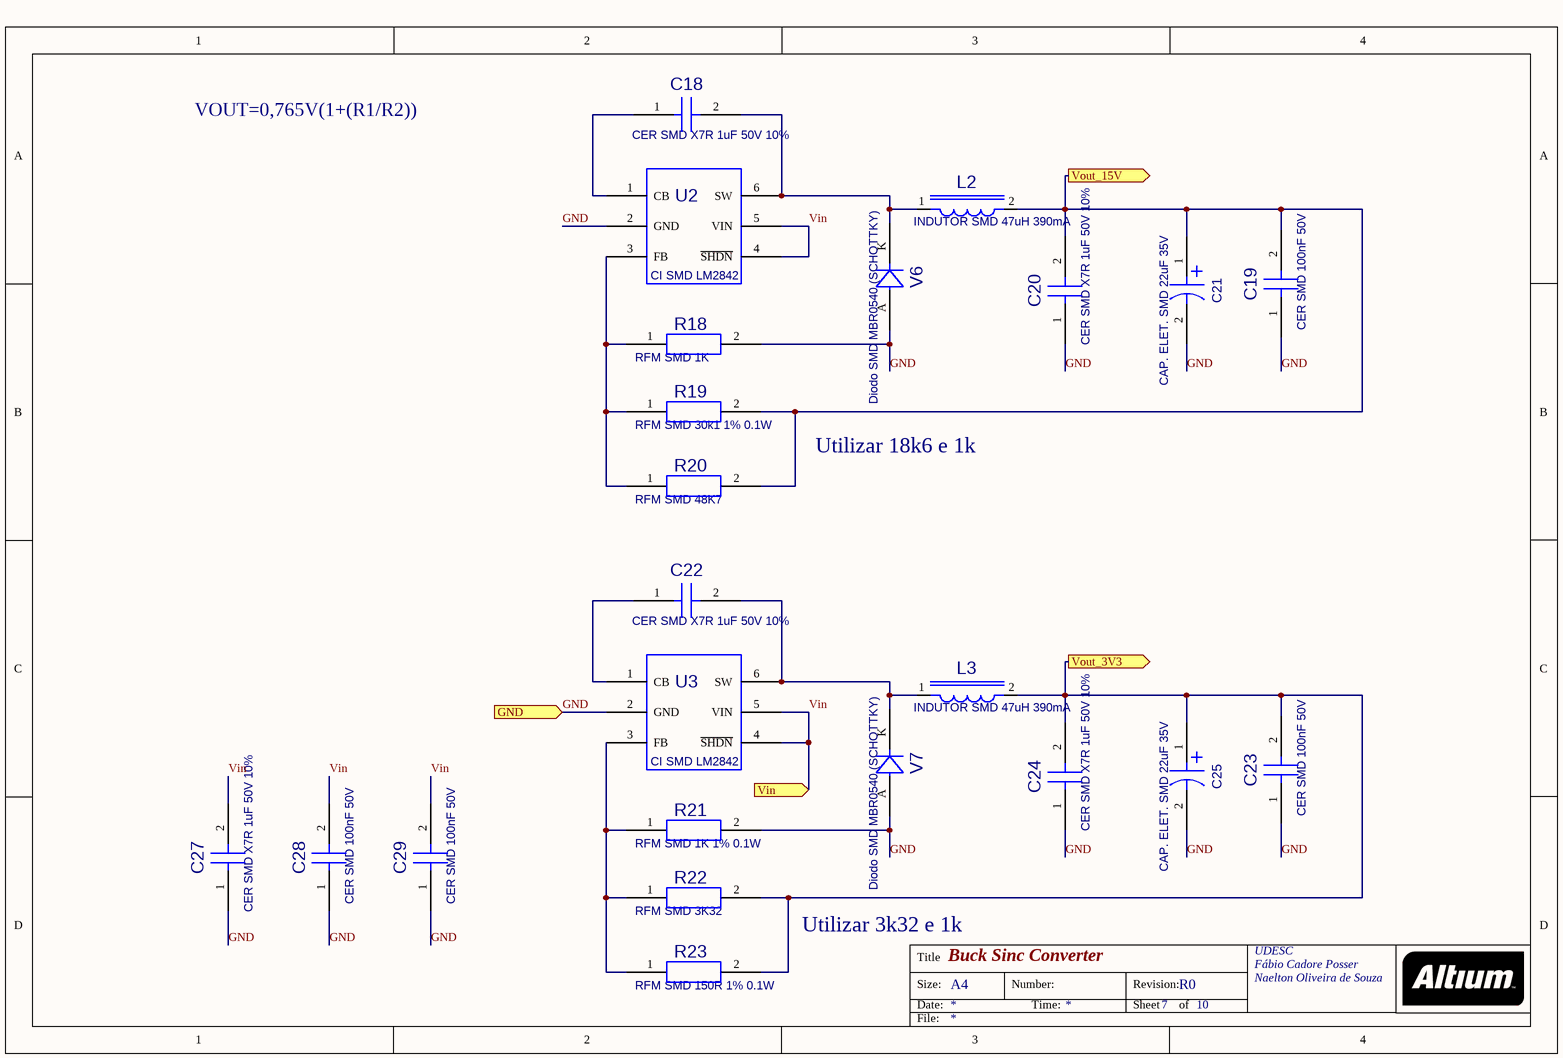
[diagram p6: SMPS.SchDoc]

### Parts
C18  value CER SMD X7R 1uF 50V 10%  [C0805_R_V0]  (hidden comment: 11736520)
C19  value CER SMD 100nF 50V  [C0805_R_V0]  (hidden comment: 10192075)
C20  value CER SMD X7R 1uF 50V 10%  [C0805_R_V0]  (hidden comment: 11736520)
C21  value CAP. ELET. SMD 22uF 35V  [CAP UUD CR 5X5.8]  (hidden comment: 11690909)
C22  value CER SMD X7R 1uF 50V 10%  [C0805_R_V0]  (hidden comment: 11736520)
C23  value CER SMD 100nF 50V  [C0805_R_V0]  (hidden comment: 10192075)
C24  value CER SMD X7R 1uF 50V 10%  [C0805_R_V0]  (hidden comment: 11736520)
C25  value CAP. ELET. SMD 22uF 35V  [CAP UUD CR 5X5.8]  (hidden comment: 11690909)
C27  value CER SMD X7R 1uF 50V 10%  [C0805_R_V0]  (hidden comment: 11736520)
C28  value CER SMD 100nF 50V  [C0805_R_V0]  (hidden comment: 10192075)
C29  value CER SMD 100nF 50V  [C0805_R_V0]  (hidden comment: 10192075)
L2  value INDUTOR SMD 47uH 390mA  [L1210]  (hidden comment: 12924787)
L3  value INDUTOR SMD 47uH 390mA  [L1210]  (hidden comment: 12924787)
R18  value RFM SMD 1K  [R0805_R_V0]  (hidden comment: 10118077)
R19  value RFM SMD 30k1 1% 0.1W  [R0805_R_V0]  (hidden comment: 10191986)
R20  value RFM SMD 48K7  [R0805_R_V0]  (hidden comment: 10192020)
R21  value RFM SMD 1K 1% 0.1W  [R0805_R_V0]  (hidden comment: 10118077)
R22  value RFM SMD 3K32  [R0805_R_V0]  (hidden comment: 10191979)
R23  value RFM SMD 150R 1% 0.1W  [R0805_R_V0]  (hidden comment: 10191981)
U2  value CI SMD LM2842  [SOT23-6]  (hidden comment: 12576507)
U3  value CI SMD LM2842  [SOT23-6]  (hidden comment: 12576507)
V6  value Diodo SMD MBR0540 (SCHOTTKY)  [SOD123A]  (hidden comment: 10192125)
V7  value Diodo SMD MBR0540 (SCHOTTKY)  [SOD123A]  (hidden comment: 10192125)

### Ports
GND (in), Vin (in), Vout_3V3 (out), Vout_15V (out)

### Nets
3V3: C23.2 C24.2 C25.1 L3.2 R22.2 R23.2 ; port Vout_3V3
15V: C19.2 C20.2 C21.1 L2.2 R19.2 R20.2 ; port Vout_15V
GND: C19.1 C20.1 C21.2 C23.1 C24.1 C25.2 C27.1 C28.1 C29.1 R18.2 R21.2 U2.2(GND) U3.2(GND) V6.A V7.A ; port GND
Vin: C27.2 C28.2 C29.2 U2.4(~{SHDN}) U2.5(VIN) U3.4(~{SHDN}) U3.5(VIN) ; port Vin  [project net Bat_+]
NetC18_1: C18.1 U2.1(CB)
NetC18_2: C18.2 L2.1 U2.6(SW) V6.K
NetC22_1: C22.1 U3.1(CB)
NetC22_2: C22.2 L3.1 U3.6(SW) V7.K
NetR18_1: R18.1 R19.1 R20.1 U2.3(FB)
NetR21_1: R21.1 R22.1 R23.1 U3.3(FB)

### Notes on the sheet
- VOUT=0,765V(1+(R1/R2))
- Utilizar 18k6 e 1k
- Utilizar 3k32 e 1k
- Title
- Size:
- Date:
- A4
- Number:
- Time:
- Revision:
- Sheet
- of
- File:

### Library data of the parts
C18 C20 C22 C24 C27 = 11736520: as C31 on sheet uC; PN: 11736520; PMT: SMD
C19 C23 C28 C29 = 10192075: as C3 on sheet Converter; PN: 10192075; PMT: SMD
C21 C25 = 11690909: as C26 on sheet Driver_rect; PN: 11690909; PMT: SMD; ComponenteLink1URL: *
L2 L3 = 12924787: INDUTOR SMD 47uH 390mA; HISsym: Atualizado em 09/08/05; HISitem: Criado em 05//03/13 (p/ Itamar); Altura: 4,8mm; PN: 12924787; PMT: SMD
R18 = 10191981: RFM SMD 1K; HISsym: Atualizado em 20/07/05; PN: 10118077; PMT: SMD
R19 = 10191981: RFM SMD 30k1 1% 0.1W; HISsym: Atualizado em 20/07/05; PN: 10191986; PMT: SMD
R20 = 10191981: RFM SMD 48K7; HISsym: Atualizado em 20/07/05; PN: 10192020; PMT: SMD
R21 = 10191981: RFM SMD 1K 1% 0.1W; HISsym: Atualizado em 20/07/05; PN: 10118077; PMT: SMD
R22 = 10191981: RFM SMD 3K32; HISsym: Atualizado em 20/07/05; PN: 10191979; PMT: SMD
R23 = 10191981: RFM SMD 150R 1% 0.1W; HISsym: Atualizado em 20/07/05; PN: 10191981; PMT: SMD
U2 U3 = 12576507: CI SMD LM2842; HISitem: Criado em 18/09/13 (p/ Afonso); PN: 12576507; PMT: SMD
V6 V7 = 10192125: Diodo SMD MBR0540 (SCHOTTKY); HISsym: Atualizado em 17/04/06; NUMBER PIN: 02; ITEM BAAN: 0334.0219; PN: 10192125; PMT: SMD

## Sheet Driver_SW.SchDoc: Buck Sinc Converter
size A4; Organization: UDESC; Revision: R0; SheetNumber: 3; SheetTotal: 10
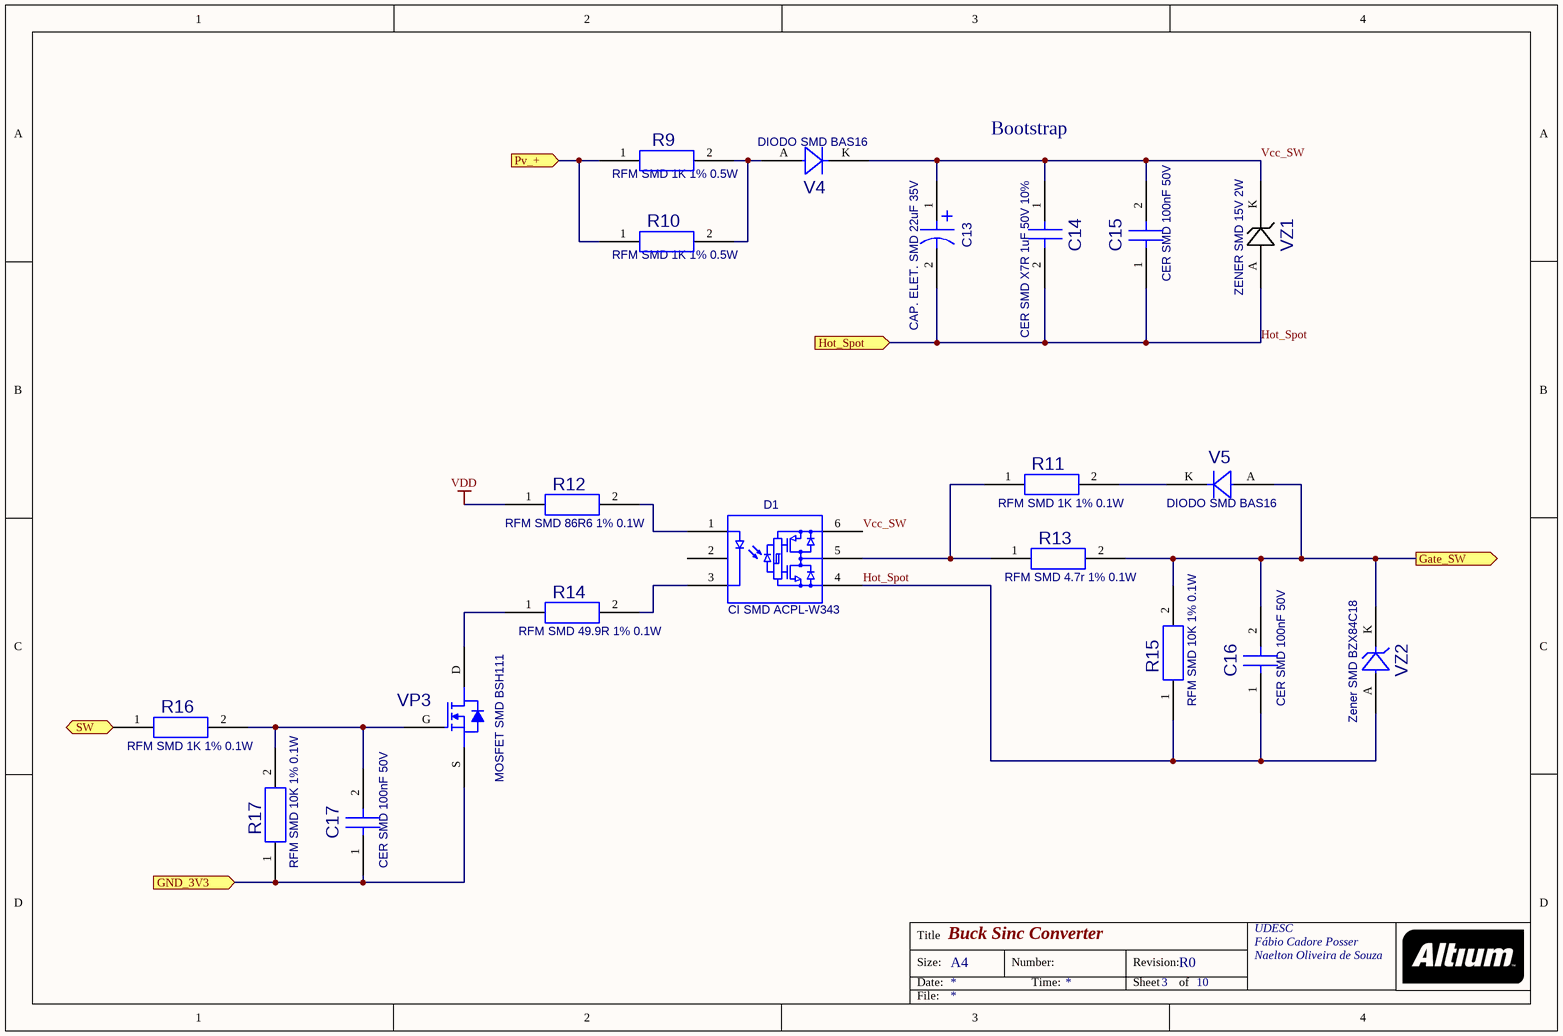
[diagram p7: Driver_SW.SchDoc]

### Parts
C13  value CAP. ELET. SMD 22uF 35V  [CAP UUD CR 5X5.8]  (hidden comment: 11690909)
C14  value CER SMD X7R 1uF 50V 10%  [C0805_R_V0]  (hidden comment: 11736520)
C15  value CER SMD 100nF 50V  [C0805_R_V0]  (hidden comment: 10192075)
C16  value CER SMD 100nF 50V  [C0805_R_V0]  (hidden comment: 10192075)
C17  value CER SMD 100nF 50V  [C0805_R_V0]  (hidden comment: 10192075)
D1  value CI SMD ACPL-W343  [SO-6 (11.5 MM)]  (hidden comment: 12544475)
R9  value RFM SMD 1K 1% 0.5W  [R2010A]  (hidden comment: 10191999)
R10  value RFM SMD 1K 1% 0.5W  [R2010A]  (hidden comment: 10191999)
R11  value RFM SMD 1K 1% 0.1W  [R0805_R_V0]  (hidden comment: 10118077)
R12  value RFM SMD 86R6 1% 0.1W  [R0805_R_V0]  (hidden comment: 10192050)
R13  value RFM SMD 4.7r 1% 0.1W  [R0805_R_V0]  (hidden comment: 10192015)
R14  value RFM SMD 49.9R 1% 0.1W  [R0805_R_V0]  (hidden comment: 10192035)
R15  value RFM SMD 10K 1% 0.1W  [R0805_R_V0]  (hidden comment: 10118076)
R16  value RFM SMD 1K 1% 0.1W  [R0805_R_V0]  (hidden comment: 10118077)
R17  value RFM SMD 10K 1% 0.1W  [R0805_R_V0]  (hidden comment: 10118076)
V4  value DIODO SMD BAS16  [SOT23A]  (hidden comment: 10261302)
V5  value DIODO SMD BAS16  [SOT23A]  (hidden comment: 10261302)
VP3  value MOSFET SMD BSH111  [MOS_SOT23A]  (hidden comment: 11110327)
VZ1  value ZENER SMD 15V 2W  [DO-214AC_12665621(Primary)]  (hidden comment: 12665621)
VZ2  value Zener SMD BZX84C18  [ZEN_SOT23A]  (hidden comment: 10050447)

### Ports
Gate_SW (out), GND_3V3 (in), Hot_Spot (in), Pv_+ (in), SW (in)

### Nets
GND: C17.1 R17.1 VP3.S ; port GND_3V3
VDD: R12.1
Gate_SW: C16.2 R13.2 R15.2 V5.A VZ2.K ; port Gate_SW
Hot_Spot: C13.2 C14.2 C15.1 C16.1 D1.4(VEE) R15.1 VZ1.A VZ2.A ; port Hot_Spot
Pv_+: R9.1 R10.1 ; port Pv_+
PWM2B: R16.1 ; port SW
Vcc_SW: C13.1 C14.1 C15.2 D1.6(VCC) V4.K VZ1.K
NetC17_2: C17.2 R16.2 R17.2 VP3.G
NetD1_1: D1.1(A) R12.2
NetD1_3: D1.3(K) R14.2
NetD1_5: D1.5(VOUT) R11.1 R13.1
NetR9_2: R9.2 R10.2 V4.A
NetR11_2: R11.2 V5.K
NetR14_1: R14.1 VP3.D

Not connected (* = marked no-connect by the designer): D1 2; V4 NC; V5 NC; VZ2 NC

### Notes on the sheet
- Bootstrap
- Title
- Size:
- Date:
- A4
- Number:
- Time:
- Revision:
- Sheet
- of
- File:

### Library data of the parts
C13 = 11690909: as C26 on sheet Driver_rect; PN: 11690909; PMT: SMD; ComponenteLink1URL: *
C14 = 11736520: as C31 on sheet uC; PN: 11736520; PMT: SMD
C15-C17 = 10192075: as C3 on sheet Converter; PN: 10192075; PMT: SMD
D1 = 12544475: as D2 on sheet Driver_rect; PN: 12544475; PMT: SMD; ComponentLink1URL: http://www.avagotech.com/docs/AV02-2928EN
R9 R10 = 10191999: RFM SMD 1K 1% 0.5W; HISsym: Atualizado em 20/07/05; PN: 10191999; PMT: SMD
R11 R16 = 10118077: as R35 on sheet Voltage_measure; PN: 10118077; PMT: SMD
R12 = 10118077: as R39 on sheet Driver_rect; PN: 10192050; PMT: SMD
R13 = 10118077: as R40 on sheet Driver_rect; PN: 10192015; PMT: SMD
R14 = 10118077: as R41 on sheet Driver_rect; PN: 10192035; PMT: SMD
R15 R17 = 10118077: as R34 on sheet Voltage_measure; PN: 10118076; PMT: SMD
V4 V5 = 10261302: as V9 on sheet Driver_rect; PN: 10261302; PMT: SMD
VP3 = 11110327: as VP4 on sheet Driver_rect; PN: 11110327; PMT: SMD
VZ1 = 12665621: ZENER SMD 15V 2W; HISsym: Atualizado em 11/07/06; HISitem: Criado em 13/12/13 (p/ Sandro W.); PN: 12665621; PMT: SMD
VZ2 = 10050447: as VZ3 on sheet Driver_rect; PN: 10050447; PMT: SMD

## Sheet Output.SchDoc: Buck Sinc Converter
size A4; Organization: UDESC; Revision: R0; SheetNumber: 9; SheetTotal: 10
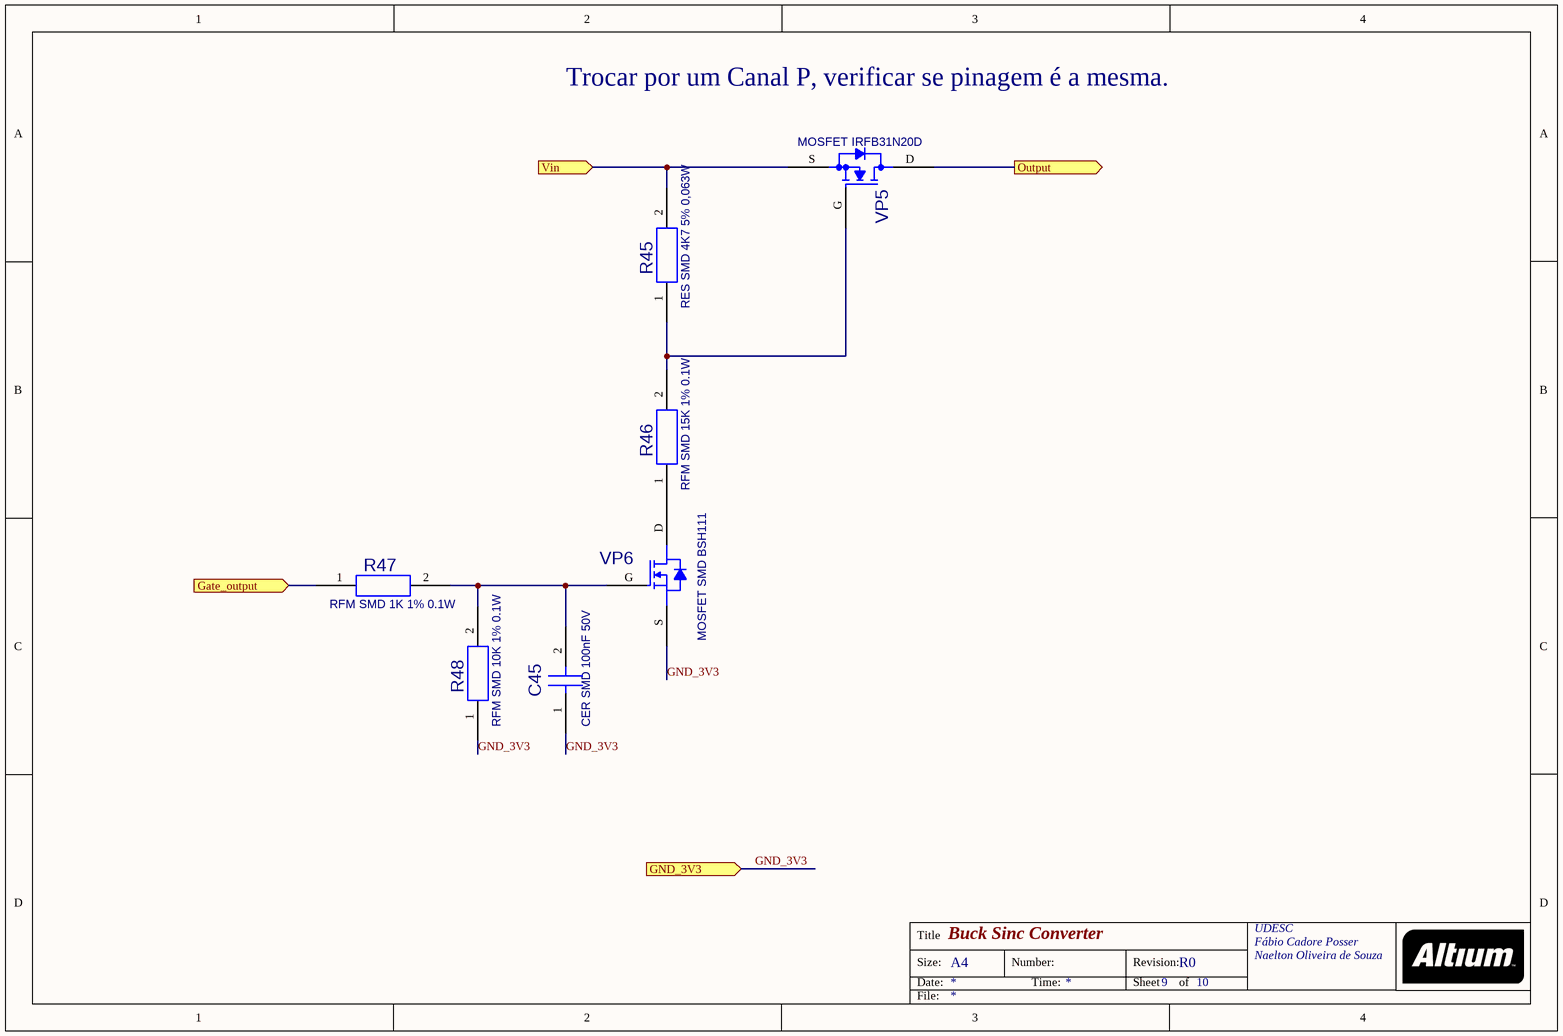
[diagram p8: Output.SchDoc]

### Parts
C45  value CER SMD 100nF 50V  [C0805_R_V0]  (hidden comment: 10192075)
R45  value RES SMD 4K7 5% 0,063W  [R0805_R_V0]  (hidden comment: 11417855)
R46  value RFM SMD 15K 1% 0.1W  [R0805_R_V0]  (hidden comment: 10118078)
R47  value RFM SMD 1K 1% 0.1W  [R0805_R_V0]  (hidden comment: 10118077)
R48  value RFM SMD 10K 1% 0.1W  [R0805_R_V0]  (hidden comment: 10118076)
VP5  value MOSFET IRFB31N20D  [TO-220AB (Primary)]  (hidden comment: 10190449)
VP6  value MOSFET SMD BSH111  [MOS_SOT23A]  (hidden comment: 11110327)

### Ports
Gate_output (in), GND_3V3 (in), Output (out), Vin (in)

### Nets
Bat_+: R45.2 VP5.S ; port Vin
GND_3V3: C45.1 R48.1 VP6.S ; port GND_3V3  [project net GND]
Output: VP5.D ; port Output
PWM1B: R47.1 ; port Gate_output
NetC45_2: C45.2 R47.2 R48.2 VP6.G
NetR45_1: R45.1 R46.2 VP5.G
NetR46_1: R46.1 VP6.D

### Notes on the sheet
- Trocar por um Canal P, verificar se pinagem é a mesma.
- Title
- Size:
- Date:
- A4
- Number:
- Time:
- Revision:
- Sheet
- of
- File:

### Library data of the parts
C45 = 10192075: as C3 on sheet Converter; PN: 10192075; PMT: SMD
R45 = 10118077: RES SMD 4K7 5% 0,063W; HISsym: Atualizado em 20/07/05; PN: 11417855; PMT: SMD
R46 = 10118077: RFM SMD 15K 1% 0.1W; HISsym: Atualizado em 20/07/05; PN: 10118078; PMT: SMD
R47 = 10118077: as R35 on sheet Voltage_measure; PN: 10118077; PMT: SMD
R48 = 10118077: as R34 on sheet Voltage_measure; PN: 10118076; PMT: SMD
VP5 = 10190449: as VP1 on sheet Converter; PN: 10190449
VP6 = 11110327: as VP4 on sheet Driver_rect; PN: 11110327; PMT: SMD

## Sheet FAN.SchDoc: Buck Sinc Converter
size A4; Organization: UDESC; Revision: R0; SheetNumber: 10; SheetTotal: 10
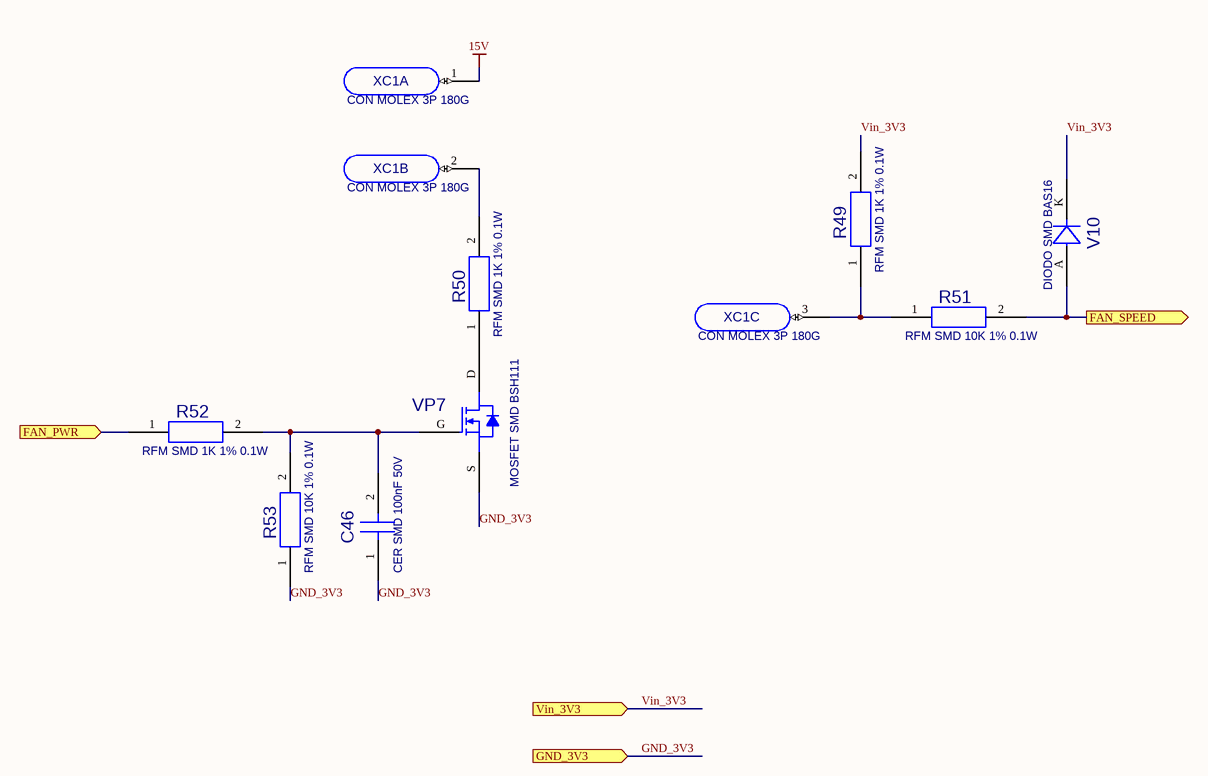
[diagram p9: FAN.SchDoc]

### Parts
(Parts that share a designator on the sheet are numbered #1, #2 ... from top to bottom, then left to right.)
C46#2  value CER SMD 100nF 50V  [C0805_R_V0]  (hidden comment: 10192075)
R49  value RFM SMD 1K 1% 0.1W  [R0805_R_V0]  (hidden comment: 10118077)
R50#2  value RFM SMD 1K 1% 0.1W  [R0805_R_V0]  (hidden comment: 10118077)
R51#2  value RFM SMD 10K 1% 0.1W  [R0805_R_V0]  (hidden comment: 10118076)
R52#2  value RFM SMD 1K 1% 0.1W  [R0805_R_V0]  (hidden comment: 10118077)
R53#2  value RFM SMD 10K 1% 0.1W  [R0805_R_V0]  (hidden comment: 10118076)
V10  value DIODO SMD BAS16  [SOT23A]  (hidden comment: 10261302)
VP7  value MOSFET SMD BSH111  [MOS_SOT23A]  (hidden comment: 11110327)
XC1  value CON MOLEX 3P 180G  [MOLEX 3P 180G M]  (hidden comment: 10190697)  (parts A,B,C of 3)

### Ports
FAN_PWR (in), FAN_SPEED (out), GND_3V3 (in), Vin_3V3 (in)

### Nets
15V: XC1.1(P1)
GND_3V3: C46#2.1 R53#2.1 VP7.S ; port GND_3V3  [project net GND]
Vin_3V3: R49.2 V10.K ; port Vin_3V3  [project net VDD]
FAN_SPEED: R51#2.2 V10.A ; port FAN_SPEED
PWM1A: R52#2.1 ; port FAN_PWR
NetC46#2_2: C46#2.2 R52#2.2 R53#2.2 VP7.G
NetR49_1: R49.1 R51#2.1 XC1.3(P1)
NetR50#2_1: R50#2.1 VP7.D
NetR50#2_2: R50#2.2 XC1.2(P1)

Not connected (* = marked no-connect by the designer): V10 NC

### Notes on the sheet
- Title
- Size:
- Date:
- A4
- Number:
- Time:
- Revision:
- Sheet
- of
- File:

### Library data of the parts
C46#2 = 10192075: as C3 on sheet Converter; PN: 10192075; PMT: SMD
R49 R50#2 R52#2 = 10118077: as R35 on sheet Voltage_measure; PN: 10118077; PMT: SMD
R51#2 R53#2 = 10118077: as R34 on sheet Voltage_measure; PN: 10118076; PMT: SMD
V10 = 10261302: as V9 on sheet Driver_rect; PN: 10261302; PMT: SMD
VP7 = 11110327: as VP4 on sheet Driver_rect; PN: 11110327; PMT: SMD
XC1 = 10190697: CON MOLEX 3P 180G; HISsym: Atualizado em 06/07/05; NUMBER PIN: 03; PMT: THT; PN: 10190697; ComponenteLink1URL: *

## Nets that join several sheets
3V3: uC (C34.1 C35.1 L4.1 L5.2), SMPS (6 pins)
15V: Driver_rect (C26.1 C43.2 C44.2 D2.6), SMPS (6 pins), FAN (XC1.1)
-PV: Converter (8 pins), Driver_rect (7 pins), Current_measure (R6.1)
Bat_+: Converter (7 pins), Converter/Voltage_measure_bat (R50#1.2), SMPS (7 pins), Output (R45.2 VP5.S)
GND: Buck_converter (V1.A V2.A V3.A), uC (18 pins), Converter (9 pins), Converter/Voltage_measure_pv (C47.1 R56.1 R57.1), Converter/Voltage_measure_bat (C46#1.1 R52#1.1 R53#1.1), Driver_rect (C42.1 R44.1 VP4.S), Current_measure (5 pins), SMPS (15 pins), Driver_SW (C17.1 R17.1 VP3.S), Output (C45.1 R48.1 VP6.S), FAN (C46#2.1 R53#2.1 VP7.S)
VDD: uC (13 pins), Driver_rect (R39.1), Driver_SW (R12.1), FAN (R49.2 V10.K)
VDDA: Buck_converter (V1.K V2.K V3.K), uC (C30.1 IC1.11 L5.1), Current_measure (C12.2 U1.5)
FAN_SPEED: uC (IC1.25), FAN (R51#2.2 V10.A)
Gate_Rect: Converter (VP2.G), Driver_rect (5 pins)
Gate_SW: Converter (VP1.G), Driver_SW (5 pins)
Hot_Spot: Converter (L1.1 VP1.S VP2.D), Driver_SW (8 pins)
Io: Buck_converter (V3.AK), uC (IC1.9), Current_measure (C10.2 R8.2)
Output: Converter (PF3.2), Output (VP5.D)
Pv_+: Converter (6 pins), Converter/Voltage_measure_pv (R54.2), Driver_SW (R9.1 R10.1)
PWM1A: uC (IC1.29), FAN (R52#2.1)
PWM1B: uC (IC1.28), Output (R47.1)
PWM2B: uC (IC1.38), Driver_SW (R16.1)
PWM3A: uC (IC1.39), Driver_rect (R43.1)
Vbat: Buck_converter (V1.AK), uC (IC1.7), Converter/Voltage_measure_bat (C46#1.2 R51#1.1)
Vin_pv: Buck_converter (V2.AK), uC (IC1.5), Converter/Voltage_measure_pv (C47.2 R55.1)

## Assembly variants
Buck_converter_R0: not fitted C13 C14 C20 C21 C22 C23 C41 C42 L1 R9 R18 R25 R26 R27 R28 R29 R39 V4 V6 V7 VP1 VP2 VP5 X3 XC1